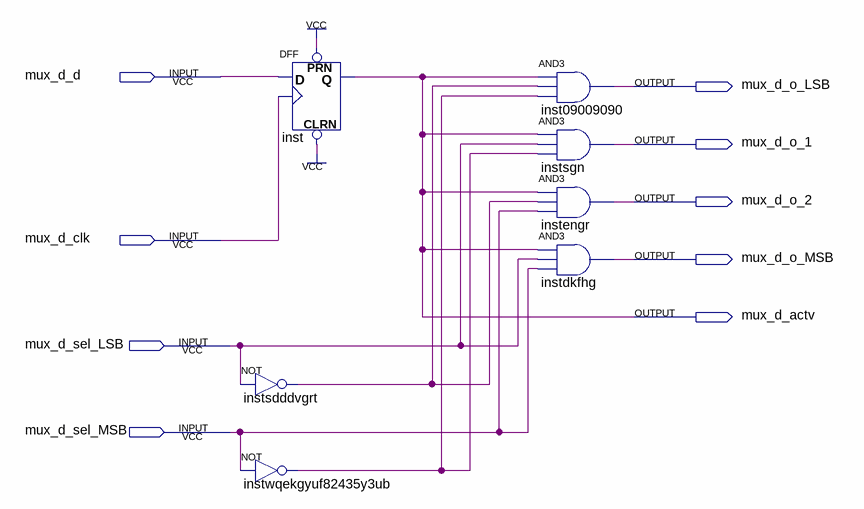
[diagram p0: schematic sheet]
// Quartus schematic mux_d.bdf as structural Verilog: 7 symbols, 9 pins
module mux_d (
  input  mux_d_d,
  input  mux_d_clk,
  input  mux_d_sel_LSB,
  input  mux_d_sel_MSB,
  output mux_d_o_LSB,
  output mux_d_o_1,
  output mux_d_o_2,
  output mux_d_o_MSB,
  output mux_d_actv
);

  wire instsdddvgrt_out, instwqekgyuf82435y3ub_out;

  not instsdddvgrt (instsdddvgrt_out, mux_d_sel_LSB);
  not instwqekgyuf82435y3ub (instwqekgyuf82435y3ub_out, mux_d_sel_MSB);
  DFF inst (.CLRN(1'b1), .CLK(mux_d_clk), .D(mux_d_d), .PRN(1'b1), .Q(mux_d_actv));
  and inst09009090 (mux_d_o_LSB, mux_d_actv, instsdddvgrt_out, instwqekgyuf82435y3ub_out);
  and instsgn (mux_d_o_1, mux_d_actv, mux_d_sel_LSB, instwqekgyuf82435y3ub_out);
  and instengr (mux_d_o_2, mux_d_actv, instsdddvgrt_out, mux_d_sel_MSB);
  and instdkfhg (mux_d_o_MSB, mux_d_actv, mux_d_sel_LSB, mux_d_sel_MSB);
endmodule
